# Altium schematic sheet snake.SchDoc
size B
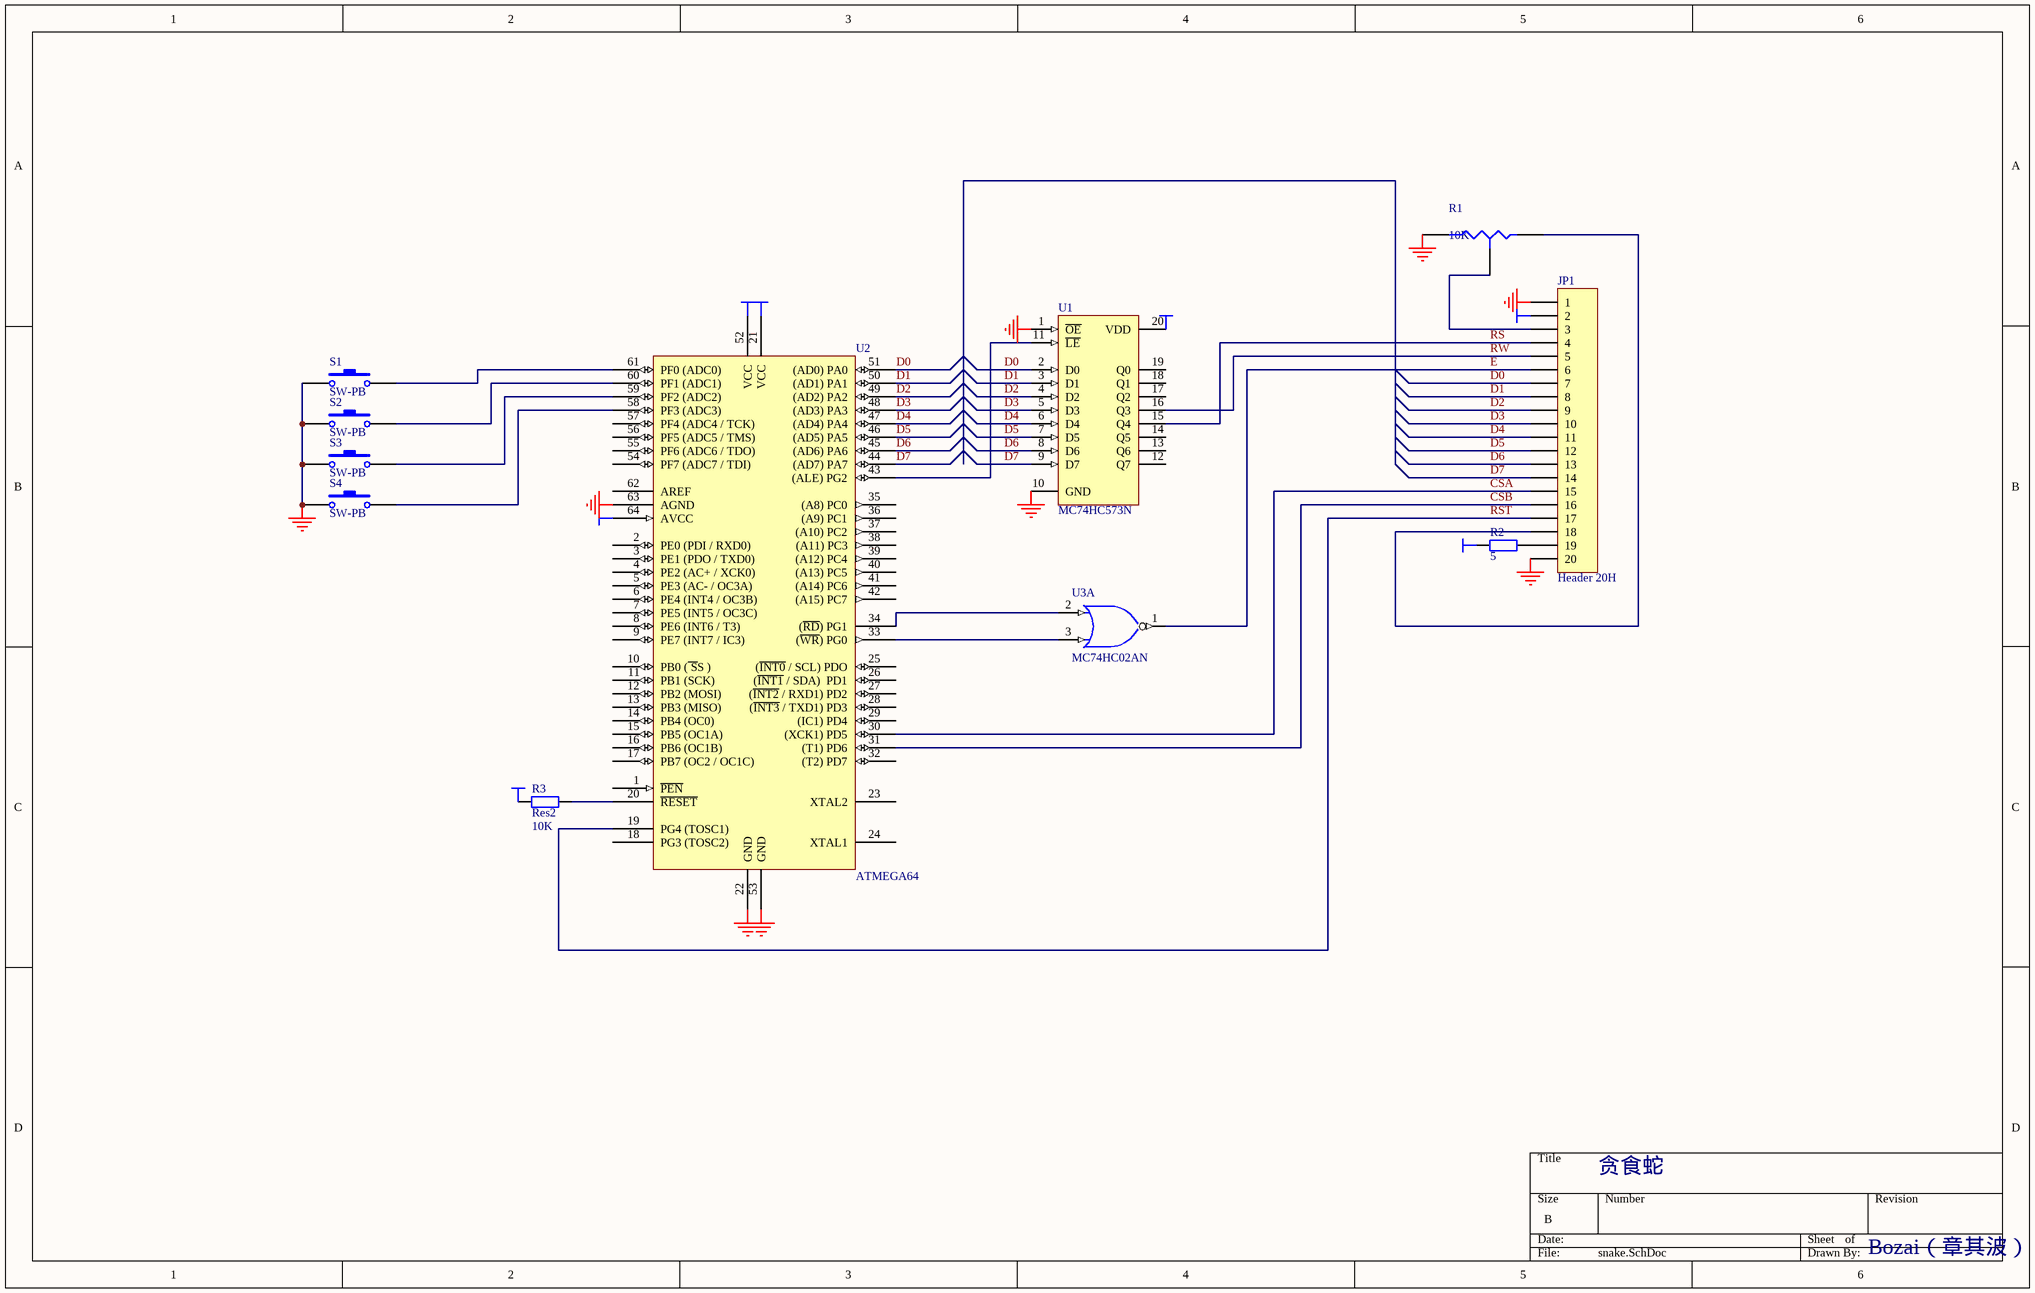
[diagram p0: snake.SchDoc]

## Parts
JP1  Header 20H  [HDR1X20H]
R1  value 10K  [VR3]
R2  value 5  [AXIAL-0.4]
R3  Res2  value 10K  [AXIAL-0.4]
S1  SW-PB  [SPST-2]
S2  SW-PB  [SPST-2]
S3  SW-PB  [SPST-2]
S4  SW-PB  [SPST-2]
U1  MC74HC573N  [DIP-20/E5.3]
U2  ATMEGA64  [TQFP-64]
U3  MC74HC02AN  [DIP-14/D19.7]  (part A of 4)

## Nets
GND: JP1.1 JP1.20 R1.2(B) S1.1 S2.1 S3.1 S4.1 U1.1(~{OE}) U1.10(GND) U2.22(GND) U2.53(GND) U2.63(AGND)
VCC: JP1.2 R2.1 R3.1 U1.20(VDD) U2.21(VCC) U2.52(VCC) U2.64(AVCC)
CSA: JP1.15 U2.30((XCK1)_PD5)
CSB: JP1.16 U2.31((T1)_PD6)
D0: JP1.7 U1.2(D0) U2.51((AD0)_PA0)
D1: JP1.8 U1.3(D1) U2.50((AD1)_PA1)
D2: JP1.9 U1.4(D2) U2.49((AD2)_PA2)
D3: JP1.10 U1.5(D3) U2.48((AD3)_PA3)
D4: JP1.11 U1.6(D4) U2.47((AD4)_PA4)
D5: JP1.12 U1.7(D5) U2.46((AD5)_PA5)
D6: JP1.13 U1.8(D6) U2.45((AD6)_PA6)
D7: JP1.14 U1.9(D7) U2.44((AD7)_PA7)
E: JP1.6 U3.1(Y)
RS: JP1.4 U1.15(Q4)
RST: JP1.17 U2.19(PG4_(TOSC1))
RW: JP1.5 U1.16(Q3)
NetJP1_3: JP1.3 R1.3(TAP)
NetJP1_18: JP1.18 R1.1(A)
NetJP1_19: JP1.19 R2.2
NetR3_2: R3.2 U2.20(~{RESET})
NetS1_2: S1.2 U2.61(PF0_(ADC0))
NetS2_2: S2.2 U2.60(PF1_(ADC1))
NetS3_2: S3.2 U2.59(PF2_(ADC2))
NetS4_2: S4.2 U2.58(PF3_(ADC3))
NetU1_11: U1.11(~{LE}) U2.43((ALE)_PG2)
NetU2_33: U2.33((~{WR})_PG0) U3.3(B)
NetU2_34: U2.34((~{RD})_PG1) U3.2(A)

Not connected (* = marked no-connect by the designer): U1 12(Q7) 13(Q6) 14(Q5) 17(Q2) 18(Q1) 19(Q0); U2 1(~{PEN}) 2(PE0_(PDI_/_RXD0)) 3(PE1_(PDO_/_TXD0)_) 4(PE2_(AC+_/_XCK0)) 5(PE3_(AC-_/_OC3A)) 6(PE4_(INT4_/_OC3B)) 7(PE5_(INT5_/_OC3C)) 8(PE6_(INT6_/_T3)) 9(PE7_(INT7_/_IC3)) 10(PB0_(~{_S}S_)) 11(PB1_(SCK)) 12(PB2_(MOSI)) 13(PB3_(MISO)) 14(PB4_(OC0)) 15(PB5_(OC1A)) 16(PB6_(OC1B)) 17(PB7_(OC2_/_OC1C)) 18(PG3_(TOSC2)) 23(XTAL2) 24(XTAL1) 25((~{INT0}_/_SCL)_PDO) 26((~{INT1}_/_SDA)__PD1) 27((~{INT2}_/_RXD1)_PD2) 28((~{INT3}_/_TXD1)_PD3) 29((IC1)_PD4) 32((T2)_PD7) 35((A8)_PC0) 36((A9)_PC1) 37((A10)_PC2) 38((A11)_PC3) 39((A12)_PC4) 40((A13)_PC5) 41((A14)_PC6) 42((A15)_PC7) 54(PF7_(ADC7_/_TDI)) 55(PF6_(ADC6_/_TDO)) 56(PF5_(ADC5_/_TMS)) 57(PF4_(ADC4_/_TCK)) 62(AREF); U3 7(GND) 14(VDD)

## Notes on the sheet
- 贪食蛇
- Bozai（章其波）

## Library data of the parts
JP1 = Header 20H: Header, 20-Pin,  Right Angle; Manufacturer: Generic Components; Class: Connector
R1 = Res Tap: Tapped Resistor; Manufacturer: Generic Components; Class: Passive; Set Position: 0.5; Published: 1999; SubClass: Resistor
R2 R3 = Res2: Resistor; Manufacturer: Generic Components; Class: Passive; Published: 08/06/2000; Publisher: Altium Hobart Technology Centre; SubClass: Resistor
S1-S4 = SW-PB: Switch; Manufacturer: Generic Components; Published: 1999
U1 = MC74HC573N: Octal 3-State Non-Inverting Transparent Latch; Manufacturer: Motorola; Class: Logic; Published: 15/04/2002; Publisher: Altium Hobart Technology Centre; SubClass: Latch
U2 = ATMEGA64: Atmel Microcontroller - Library created by carel..  <www.mpfreezone.com>; Part Field 1: *; Part Field 2: *; Part Field 3: *; Part Field 4: *; Part Field 5: *; Part Field 6: *; Part Field 7: *; Part Field 8: *; Part Field 9: *; Part Field 10: *; Part Field 11: *; Part Field 12: *; Part Field 13: *; Part Field 14: *; Part Field 15: *; Part Field 16: *
U3 = MC74HC02AN: Quad 2-Input NOR Gate; Manufacturer: Motorola; Class: Logic; Published: 15/04/2002; Publisher: Altium Hobart Technology Centre; SubClass: Gate